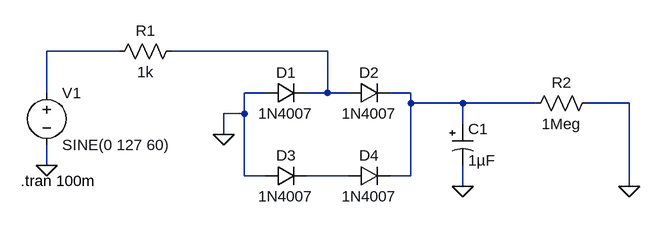
[diagram p0: schematic Ponte em H - retificador de onda completa.asc]
Ponte em H - retificador de onda completa.asc, the LTspice schematic file:
Version 4.1
SHEET 1 1220 680
WIRE 288 80 176 80
WIRE 608 80 368 80
WIRE 176 144 176 80
WIRE 512 144 480 144
WIRE 608 144 608 80
WIRE 608 144 576 144
WIRE 640 144 608 144
WIRE 736 144 704 144
WIRE 736 160 736 144
WIRE 816 160 736 160
WIRE 928 160 816 160
WIRE 1072 160 1008 160
WIRE 480 176 480 144
WIRE 480 176 448 176
WIRE 816 192 816 160
WIRE 448 208 448 176
WIRE 176 256 176 224
WIRE 480 272 480 176
WIRE 512 272 480 272
WIRE 640 272 576 272
WIRE 736 272 736 160
WIRE 736 272 704 272
WIRE 816 288 816 256
WIRE 1072 288 1072 160
FLAG 176 256 0
FLAG 448 208 0
FLAG 1072 288 0
FLAG 816 288 0
SYMBOL diode 512 160 R270
WINDOW 0 32 32 VTop 2
WINDOW 3 0 32 VBottom 2
SYMATTR InstName D1
SYMATTR Value 1N4007
SYMBOL res 384 64 R90
WINDOW 0 0 56 VBottom 2
WINDOW 3 32 56 VTop 2
SYMATTR InstName R1
SYMATTR Value 1k
SYMBOL voltage 176 128 R0
WINDOW 123 0 0 Left 0
WINDOW 39 0 0 Left 0
SYMATTR InstName V1
SYMATTR Value SINE(0 127 60)
SYMBOL diode 640 160 R270
WINDOW 0 32 32 VTop 2
WINDOW 3 0 32 VBottom 2
SYMATTR InstName D2
SYMATTR Value 1N4007
SYMBOL diode 512 288 R270
WINDOW 0 32 32 VTop 2
WINDOW 3 0 32 VBottom 2
SYMATTR InstName D3
SYMATTR Value 1N4007
SYMBOL diode 640 288 R270
WINDOW 0 32 32 VTop 2
WINDOW 3 0 32 VBottom 2
SYMATTR InstName D4
SYMATTR Value 1N4007
SYMBOL polcap 800 192 R0
SYMATTR InstName C1
SYMATTR Value 1µF
SYMBOL res 1024 144 R90
WINDOW 0 0 56 VBottom 2
WINDOW 3 32 56 VTop 2
SYMATTR InstName R2
SYMATTR Value 1Meg
TEXT 136 280 Left 2 !.tran 100m

The netlist it stands for:
* Ponte em H - retificador de onda completa.asc
D1 0 N002 1N4007
R1 N002 N001 1k
V1 N001 0 SINE(0 127 60)
D2 N002 N003 1N4007
D3 0 N004 1N4007
D4 N004 N003 1N4007
C1 N003 0 1µF
R2 0 N003 1Meg
.model D D
.lib standard.dio
.tran 100m
.backanno
.end